# EAGLE design tiny10 (EAGLE 6.5.0)
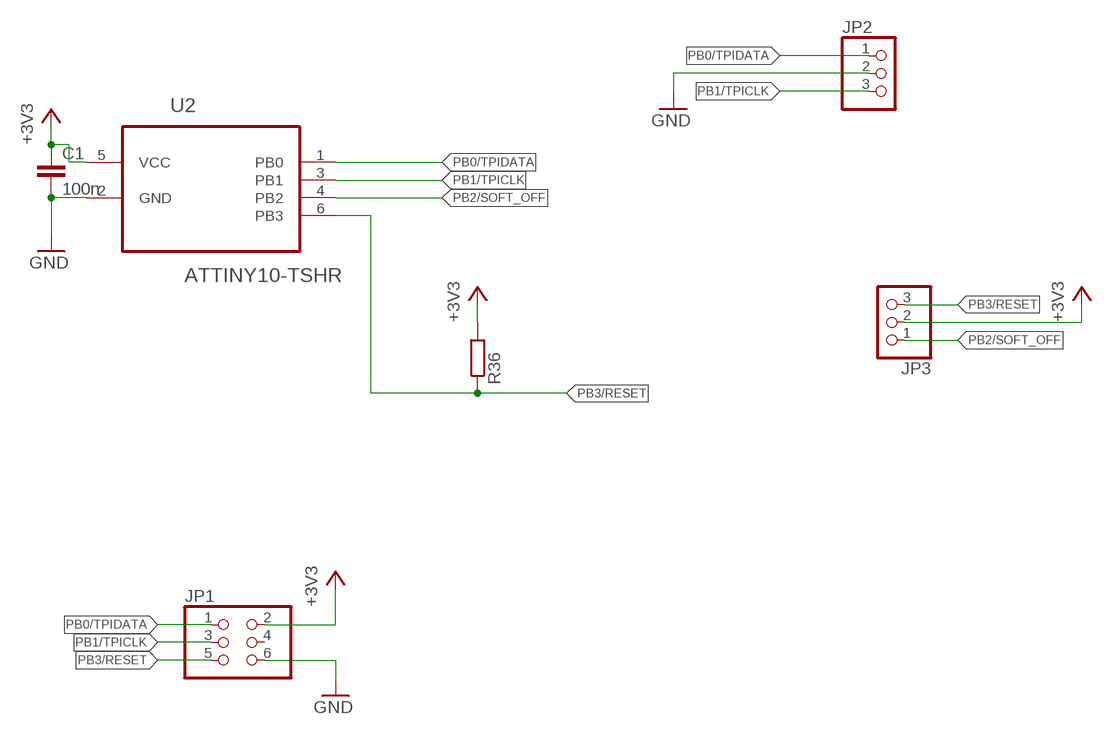
[diagram p0: schematic, sheet 1]

## Parts
C1  100n  C-EUC0603  [C0603]
JP1  PINHD-2X3  [2X03]
JP2  PINHD-1X3  [1X03]
JP3  PINHD-1X3  [1X03]
R36  R-EU_M0805  [M0805]
U2  ATTINY10-TSHR  [SOT95P280X145-6N]

## Nets
+3V3: C1.1 JP1.2 JP3.2 R36.2 U2.5(VCC)
GND: C1.2 JP1.6 JP2.2 U2.2(GND)
PB0/TPIDATA: JP1.1 JP2.1 U2.1(PB0)
PB1/TPICLK: JP1.3 JP2.3 U2.3(PB1)
PB2/SOFT_OFF: JP3.1 U2.4(PB2)
PB3/RESET: JP1.5 JP3.3 R36.1 U2.6(PB3)
Unconnected: JP1.4

## Library data of the parts
C1 = rcl:C-EU: CAPACITOR, European symbol
JP1 = pinhead:PINHD-2X3: PIN HEADER
JP2 JP3 = pinhead:PINHD-1X3: PIN HEADER
R36 = rcl:R-EU_: RESISTOR, European symbol
U2 = Atmel_By_element14_Batch_1:ATTINY10-TSHR: 8-bit Microcontroller with In-System Programmable Flash; MPN: ATTINY10-TSHR; OC_FARNELL: 1748538; OC_NEWARK: 26R5645; PACKAGE: SOT-23-6; SUPPLIER: Atmel

## Board
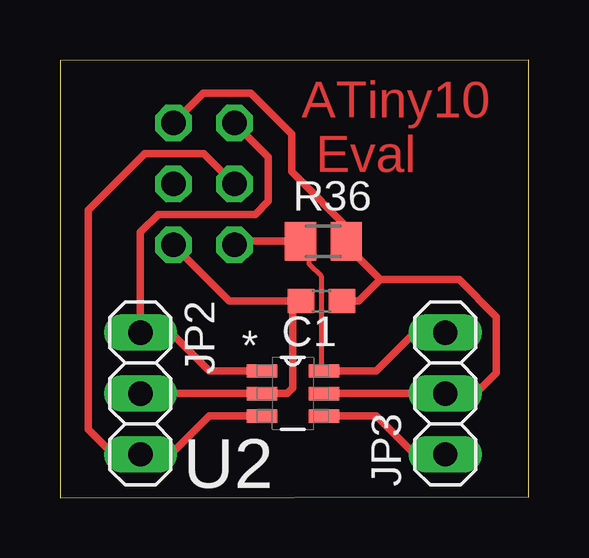
[diagram p1: board, top side]
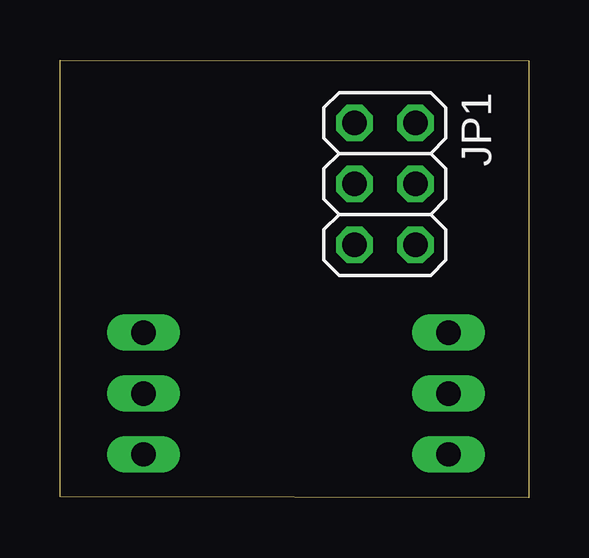
[diagram p2: board, bottom side, seen from below]

Size 19.53 x 18.25 mm. Coordinates in mm from the lower left corner, seen from the top.
Outline: 0,0 19.53,0.03 19.53,18.25 0,18.23 0,0
Copper layers (1*16): Top 0.035mm / dielectric 1.5mm / Bottom 0.035mm
Design rules "default *": minimum track width 8mil, minimum drill 24mil, track to track 8mil, track to pad 8mil, pad to pad 8mil, via to via 8mil, smd to smd 8mil, copper to edge 40mil, drill to drill 8mil, minimum pad ring 10mil, minimum via ring 8mil, stop-mask expansion 4mil, vias tented up to drill 0mil, thermal gap 10mil

### Footprints (pad centres in the part's own frame; a part is rotated, then mirrored left to right if it is on the bottom)
C0603 = smd 1.1 x 1: 1 -0.85,0; 2 0.85,0
2X03 = drill 1.016 octagon: 1 -2.54,-1.27; 2 -2.54,1.27; 3 0,-1.27; 4 0,1.27; 5 2.54,-1.27; 6 2.54,1.27
1X03 = drill 1.016 long: 1 -2.54,0; 2 0,0; 3 2.54,0
M0805 = smd 1.3 x 1.6: 1 -0.95,0; 2 0.95,0
SOT95P280X145-6N = smd 1.27 x 0.559: 1 -1.295,0.94; 2 -1.295,0; 3 -1.295,-0.94; 4 1.295,-0.94; 5 1.295,0; 6 1.295,0.94

### Placement (x,y rotation side)
C1  10.9,8.2 180 top
JP1  5.99,13.08 270 bottom
JP2  3.35,4.34 270 top
JP3  16.05,4.34 90 top
R36  10.97,10.69 0 top
U2  9.7,4.34 0 top

### Tracks (layer width: path | path; a pad name or v marks a point on that pad's centre or on a via)
+3V3
  Top 0.305: U2.5 JP3.2 17.32,4.34 18.19,5.21 18.19,7.54 16.64,9.09 13.34,9.09 | C1.1 12.45,8.2 13.34,9.09 | 13.34,9.09 11.92,10.51 R36.2 12.24,11.01 12.23,11.01 9.65,13.59 9.65,15.16 7.95,16.87 5.97,16.87 JP1.2
GND
  Top 0.305: JP2.2 U2.2 9.47,4.34 9.7,4.57 9.7,7.86 C1.2 7.06,8.2 JP1.6
PB0/TPIDATA
  Top 0.305: U2.1 6.22,5.28 4.62,6.88 JP2.1 3.35,11.07 4.09,11.81 8.13,11.81 8.69,12.37 8.69,14.2 JP1.1
PB1/TPICLK
  Top 0.305: U2.3 6.22,3.4 4.62,1.8 JP2.3 2.21,1.8 1.17,2.85 1.17,11.99 3.53,14.35 5.99,14.35 JP1.3
PB2/SOFT_OFF
  Top 0.305: U2.4 13.18,3.4 14.78,1.8 JP3.1
PB3/RESET
  Top 0.203: 10.39,10.33 10.39,9.73 10.9,9.22 10.9,5.41
  Top 0.305: JP3.3 14.78,6.88 13.18,5.28 U2.6 10.97,5.31 10.97,5.33 10.9,5.41 | 10.39,10.33 R36.1 7.42,10.69 JP1.5

### Text on the board
Top: ATiny10 / Eval